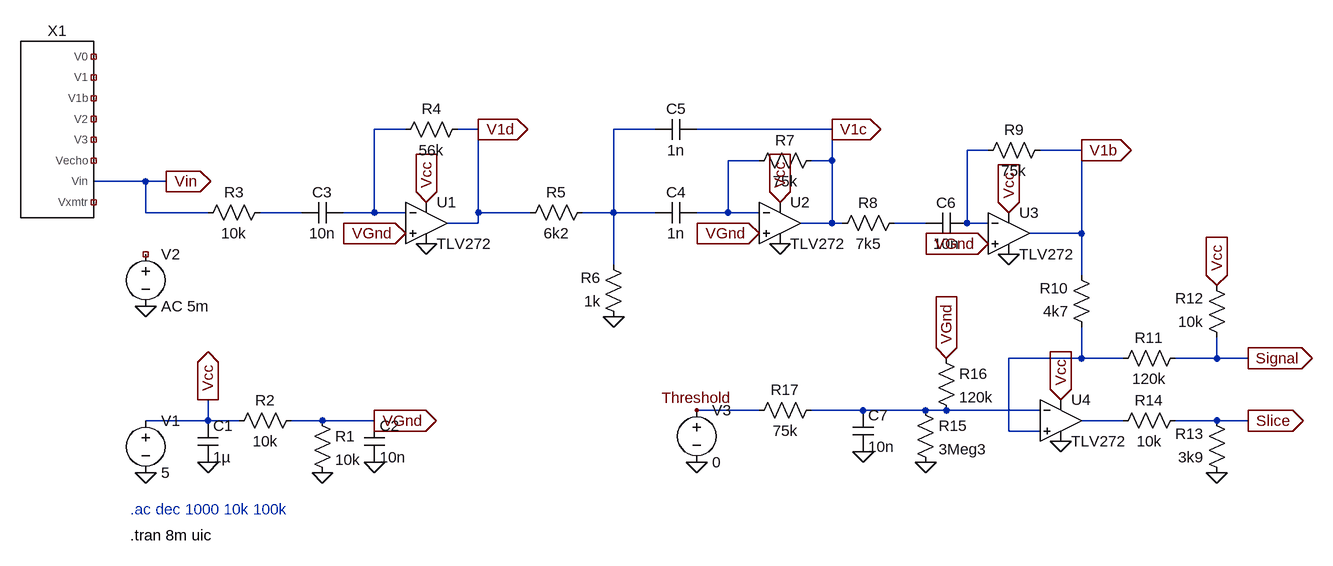
[diagram p0: schematic Lab5B4.asc]
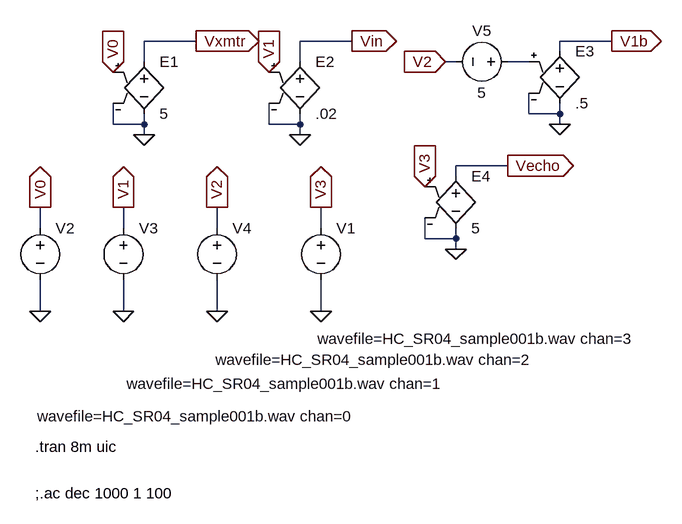
[diagram p1: sub-circuit lab5b3.asc]
Lab5B4.asc, the LTspice schematic file:
Version 4
SHEET 1 1892 680
WIRE 464 -304 416 -304
WIRE 576 -304 544 -304
WIRE 848 -304 784 -304
WIRE 1120 -304 912 -304
WIRE 1360 -272 1328 -272
WIRE 1504 -272 1440 -272
WIRE 1008 -256 960 -256
WIRE 1120 -256 1120 -304
WIRE 1120 -256 1088 -256
WIRE 64 -224 -16 -224
WIRE 96 -224 64 -224
WIRE 64 -176 64 -224
WIRE 160 -176 64 -176
WIRE 304 -176 240 -176
WIRE 416 -176 416 -304
WIRE 416 -176 368 -176
WIRE 464 -176 416 -176
WIRE 576 -176 576 -304
WIRE 656 -176 576 -176
WIRE 784 -176 784 -304
WIRE 784 -176 736 -176
WIRE 848 -176 784 -176
WIRE 960 -176 960 -256
WIRE 960 -176 912 -176
WIRE 1008 -176 960 -176
WIRE 576 -160 576 -176
WIRE 576 -160 528 -160
WIRE 1120 -160 1120 -256
WIRE 1120 -160 1072 -160
WIRE 1136 -160 1120 -160
WIRE 1264 -160 1216 -160
WIRE 1328 -160 1328 -272
WIRE 1360 -160 1328 -160
WIRE 1504 -144 1504 -272
WIRE 1504 -144 1424 -144
WIRE 784 -96 784 -176
WIRE 1504 -80 1504 -144
WIRE 1504 48 1504 0
WIRE 1504 48 1392 48
WIRE 1568 48 1504 48
WIRE 1712 48 1712 16
WIRE 1712 48 1648 48
WIRE 1760 48 1712 48
WIRE 1008 128 912 128
WIRE 1168 128 1088 128
WIRE 1264 128 1168 128
WIRE 1296 128 1264 128
WIRE 1440 128 1296 128
WIRE 160 144 160 112
WIRE 160 144 64 144
WIRE 208 144 160 144
WIRE 336 144 288 144
WIRE 416 144 336 144
WIRE 1568 144 1504 144
WIRE 1712 144 1648 144
WIRE 1760 144 1712 144
WIRE 1392 160 1392 48
WIRE 1440 160 1392 160
FLAG 160 208 0
FLAG 64 224 0
FLAG 336 224 0
FLAG 416 208 0
FLAG 416 144 VGnd
IOPIN 416 144 Out
FLAG 1712 224 0
FLAG 1472 176 0
FLAG 1264 208 0
FLAG 1168 192 0
FLAG 912 208 0
FLAG 1392 -112 0
FLAG 1040 -128 0
FLAG 496 -128 0
FLAG 784 -16 0
FLAG 64 -32 0
FLAG 96 -224 Vin
IOPIN 96 -224 Out
FLAG 160 112 Vcc
IOPIN 160 112 Out
FLAG 1040 -192 Vcc
IOPIN 1040 -192 In
FLAG 496 -192 Vcc
IOPIN 496 -192 In
FLAG 1392 -176 Vcc
IOPIN 1392 -176 In
FLAG 1472 112 Vcc
IOPIN 1472 112 In
FLAG 1712 -64 Vcc
IOPIN 1712 -64 In
FLAG 576 -304 V1d
IOPIN 576 -304 Out
FLAG 1120 -304 V1c
IOPIN 1120 -304 Out
FLAG 1504 -272 V1b
IOPIN 1504 -272 Out
FLAG 1760 48 Signal
IOPIN 1760 48 Out
FLAG 1760 144 Slice
IOPIN 1760 144 Out
FLAG 1296 48 VGnd
IOPIN 1296 48 In
FLAG 1360 -128 VGnd
IOPIN 1360 -128 In
FLAG 464 -144 VGnd
IOPIN 464 -144 In
FLAG 1008 -144 VGnd
IOPIN 1008 -144 In
FLAG 912 128 Threshold
SYMBOL voltage 64 128 R0
WINDOW 123 0 0 Left 0
WINDOW 39 0 0 Left 0
SYMATTR InstName V1
SYMATTR Value 5
SYMBOL cap 144 144 R0
SYMATTR InstName C1
SYMATTR Value 1µ
SYMBOL cap 400 144 R0
SYMATTR InstName C2
SYMATTR Value 10n
SYMBOL res 320 128 R0
SYMATTR InstName R1
SYMATTR Value 10k
SYMBOL res 304 128 R90
WINDOW 0 0 56 VBottom 2
WINDOW 3 32 56 VTop 2
SYMATTR InstName R2
SYMATTR Value 10k
SYMBOL voltage 64 -128 R0
WINDOW 123 0 0 Left 0
WINDOW 39 0 0 Left 0
SYMATTR InstName V2
SYMATTR Value AC 5m
SYMBOL res 256 -192 R90
WINDOW 0 0 56 VBottom 2
WINDOW 3 32 56 VTop 2
SYMATTR InstName R3
SYMATTR Value 10k
SYMBOL cap 368 -192 R90
WINDOW 0 0 32 VBottom 2
WINDOW 3 32 32 VTop 2
SYMATTR InstName C3
SYMATTR Value 10n
SYMBOL res 560 -320 R90
WINDOW 0 0 56 VBottom 2
WINDOW 3 32 56 VTop 2
SYMATTR InstName R4
SYMATTR Value 56k
SYMBOL res 752 -192 R90
WINDOW 0 0 56 VBottom 2
WINDOW 3 32 56 VTop 2
SYMATTR InstName R5
SYMATTR Value 6k2
SYMBOL TLV272 496 -160 R0
SYMATTR InstName U1
SYMBOL TLV272 1040 -160 R0
SYMATTR InstName U2
SYMBOL TLV272 1392 -144 R0
SYMATTR InstName U3
SYMBOL TLV272 1472 144 R0
SYMATTR InstName U4
SYMBOL res 800 0 R180
WINDOW 0 36 76 Left 2
WINDOW 3 36 40 Left 2
SYMATTR InstName R6
SYMATTR Value 1k
SYMBOL cap 912 -192 R90
WINDOW 0 0 32 VBottom 2
WINDOW 3 32 32 VTop 2
SYMATTR InstName C4
SYMATTR Value 1n
SYMBOL cap 912 -320 R90
WINDOW 0 0 32 VBottom 2
WINDOW 3 32 32 VTop 2
SYMATTR InstName C5
SYMATTR Value 1n
SYMBOL res 1104 -272 R90
WINDOW 0 0 56 VBottom 2
WINDOW 3 32 56 VTop 2
SYMATTR InstName R7
SYMATTR Value 75k
SYMBOL res 1232 -176 R90
WINDOW 0 0 56 VBottom 2
WINDOW 3 32 56 VTop 2
SYMATTR InstName R8
SYMATTR Value 7k5
SYMBOL cap 1328 -176 R90
WINDOW 0 0 32 VBottom 2
WINDOW 3 32 32 VTop 2
SYMATTR InstName C6
SYMATTR Value 10n
SYMBOL res 1456 -288 R90
WINDOW 0 0 56 VBottom 2
WINDOW 3 32 56 VTop 2
SYMATTR InstName R9
SYMATTR Value 75k
SYMBOL res 1520 16 R180
WINDOW 0 36 76 Left 2
WINDOW 3 36 40 Left 2
SYMATTR InstName R10
SYMATTR Value 4k7
SYMBOL res 1664 32 R90
WINDOW 0 0 56 VBottom 2
WINDOW 3 32 56 VTop 2
SYMATTR InstName R11
SYMATTR Value 120k
SYMBOL res 1728 32 R180
WINDOW 0 36 76 Left 2
WINDOW 3 36 40 Left 2
SYMATTR InstName R12
SYMATTR Value 10k
SYMBOL res 1728 240 R180
WINDOW 0 36 76 Left 2
WINDOW 3 36 40 Left 2
SYMATTR InstName R13
SYMATTR Value 3k9
SYMBOL res 1552 160 R270
WINDOW 0 32 56 VTop 2
WINDOW 3 0 56 VBottom 2
SYMATTR InstName R14
SYMATTR Value 10k
SYMBOL res 1248 112 R0
SYMATTR InstName R15
SYMATTR Value 3Meg3
SYMBOL res 1280 32 R0
SYMATTR InstName R16
SYMATTR Value 120k
SYMBOL res 1104 112 R90
WINDOW 0 0 56 VBottom 2
WINDOW 3 32 56 VTop 2
SYMATTR InstName R17
SYMATTR Value 75k
SYMBOL cap 1152 128 R0
SYMATTR InstName C7
SYMATTR Value 10n
SYMBOL voltage 912 112 R0
WINDOW 123 0 0 Left 0
WINDOW 39 0 0 Left 0
SYMATTR InstName V3
SYMATTR Value 0
SYMBOL Lab5B3 -80 -304 R0
SYMATTR InstName X1
TEXT 40 280 Left 2 ;.ac dec 1000 10k 100k
TEXT 40 320 Left 2 !.tran 8m uic

lab5b3.asc, the sub-circuit schematic file:
Version 4
SHEET 1 940 840
WIRE 192 80 112 80
WIRE 432 80 352 80
WIRE 832 80 752 80
WIRE 752 96 752 80
WIRE 112 112 112 80
WIRE 352 112 352 80
WIRE 592 112 576 112
WIRE 704 112 672 112
WIRE 704 192 704 160
WIRE 752 192 752 176
WIRE 752 192 704 192
WIRE 64 208 64 176
WIRE 112 208 112 192
WIRE 112 208 64 208
WIRE 304 208 304 176
WIRE 352 208 352 192
WIRE 352 208 304 208
WIRE 752 208 752 192
WIRE 112 224 112 208
WIRE 352 224 352 208
WIRE 672 272 592 272
WIRE 592 288 592 272
WIRE -48 368 -48 336
WIRE 80 368 80 336
WIRE 224 368 224 336
WIRE 384 368 384 336
WIRE 544 384 544 352
WIRE 592 384 592 368
WIRE 592 384 544 384
WIRE 592 400 592 384
WIRE -48 496 -48 448
WIRE 80 496 80 448
WIRE 224 496 224 448
WIRE 384 496 384 448
FLAG 112 224 0
FLAG 352 224 0
FLAG 752 208 0
FLAG 592 400 0
FLAG 384 496 0
FLAG 224 496 0
FLAG 80 496 0
FLAG -48 496 0
FLAG 64 128 V0
IOPIN 64 128 In
FLAG 304 128 V1
IOPIN 304 128 In
FLAG 544 304 V3
IOPIN 544 304 In
FLAG -48 336 V0
IOPIN -48 336 Out
FLAG 80 336 V1
IOPIN 80 336 Out
FLAG 224 336 V2
IOPIN 224 336 Out
FLAG 384 336 V3
IOPIN 384 336 Out
FLAG 672 272 Vecho
IOPIN 672 272 Out
FLAG 832 80 V1b
IOPIN 832 80 Out
FLAG 432 80 Vin
IOPIN 432 80 Out
FLAG 192 80 Vxmtr
IOPIN 192 80 Out
FLAG 576 112 V2
IOPIN 576 112 In
SYMBOL e 112 96 R0
SYMATTR InstName E1
SYMATTR Value 5
SYMBOL e 352 96 R0
SYMATTR InstName E2
SYMATTR Value .02
SYMBOL e 752 80 R0
SYMATTR InstName E3
SYMATTR Value .5
SYMBOL e 592 272 R0
SYMATTR InstName E4
SYMATTR Value 5
SYMBOL voltage 384 352 R0
WINDOW 123 0 0 Left 0
WINDOW 39 0 0 Left 0
WINDOW 3 -5 186 Left 2
SYMATTR InstName V1
SYMATTR Value wavefile=HC_SR04_sample001b.wav chan=3
SYMBOL voltage -48 352 R0
WINDOW 3 -5 305 Left 2
SYMATTR InstName V2
SYMATTR Value wavefile=HC_SR04_sample001b.wav chan=0
SYMBOL voltage 80 352 R0
WINDOW 3 5 255 Left 2
SYMATTR InstName V3
SYMATTR Value wavefile=HC_SR04_sample001b.wav chan=1
SYMBOL voltage 224 352 R0
WINDOW 123 0 0 Left 0
WINDOW 39 0 0 Left 0
WINDOW 3 -2 218 Left 2
SYMATTR InstName V4
SYMATTR Value wavefile=HC_SR04_sample001b.wav chan=2
SYMBOL voltage 688 112 R90
WINDOW 0 -32 56 VBottom 2
WINDOW 3 32 56 VTop 2
WINDOW 123 0 0 Left 0
WINDOW 39 0 0 Left 0
SYMATTR InstName V5
SYMATTR Value 5
TEXT -56 704 Left 2 !.tran 8m uic
TEXT -56 776 Left 2 !;.ac dec 1000 1 100

The netlist it stands for:
* Lab5B4.asc
V1 Vcc 0 5
C1 Vcc 0 1µ
C2 VGnd 0 10n
R1 VGnd 0 10k
R2 VGnd Vcc 10k
V2 NC_01 0 AC 5m
R3 N005 Vin 10k
C3 N001 N005 10n
R4 V1d N001 56k
R5 N002 V1d 6k2
* U1: TLV272 (symbol TLV272 not available, pins judged from their places): In+=VGnd In-=N001 V+=Vcc V-=0 OUT=V1d
* U2: TLV272 (symbol TLV272 not available, pins judged from their places): In+=VGnd In-=N004 V+=Vcc V-=0 OUT=V1c
* U3: TLV272 (symbol TLV272 not available, pins judged from their places): In+=VGnd In-=N003 V+=Vcc V-=0 OUT=V1b
* U4: TLV272 (symbol TLV272 not available, pins judged from their places): In+=N007 In-=N008 V+=Vcc V-=0 OUT=N009
R6 0 N002 1k
C4 N004 N002 1n
C5 V1c N002 1n
R7 V1c N004 75k
R8 N006 V1c 7k5
C6 N003 N006 10n
R9 V1b N003 75k
R10 N007 V1b 4k7
R11 Signal N007 120k
R12 Signal Vcc 10k
R13 0 Slice 3k9
R14 N009 Slice 10k
R15 N008 0 3Meg3
R16 VGnd N008 120k
R17 N008 Threshold 75k
C7 N008 0 10n
V3 Threshold 0 0
XX1 NC_02 NC_03 NC_04 NC_05 NC_06 NC_07 Vin NC_08 lab5b3

* block symbol definitions
.subckt lab5b3 V0 V1 V1b V2 V3 Vecho Vin Vxmtr
E1 Vxmtr 0 V0 0 5
E2 Vin 0 V1 0 .02
E3 V1b 0 N001 0 .5
E4 Vecho 0 V3 0 5
V1 V3 0 wavefile=HC_SR04_sample001b.wav chan=3
V2 V0 0 wavefile=HC_SR04_sample001b.wav chan=0
V3 V1 0 wavefile=HC_SR04_sample001b.wav chan=1
V4 V2 0 wavefile=HC_SR04_sample001b.wav chan=2
V5 N001 V2 5
.tran 8m uic
;.ac dec 1000 1 100
.ends lab5b3

* .ac dec 1000 10k 100k
.tran 8m uic
.backanno
.end